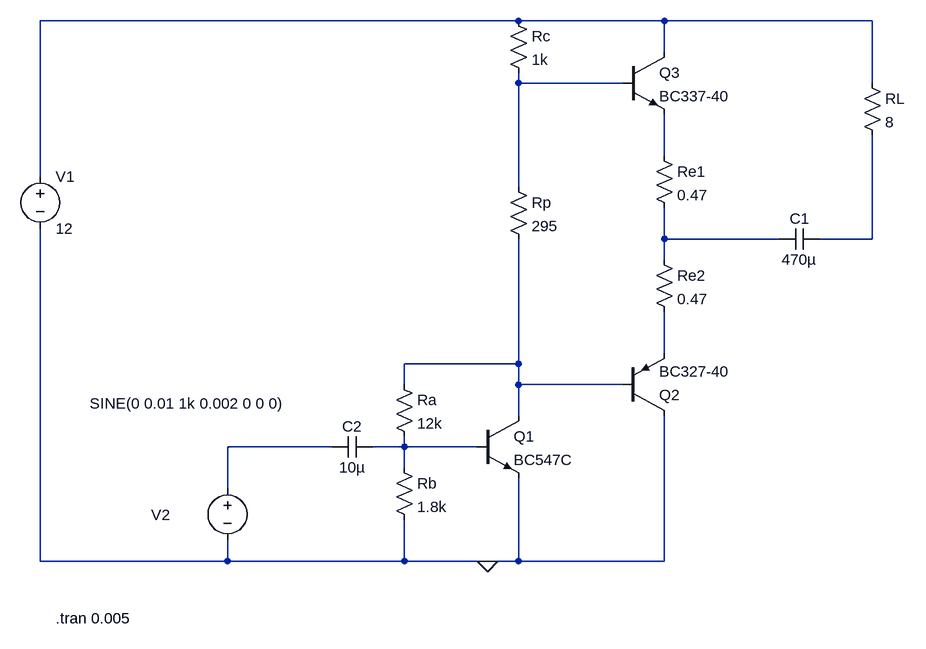
[diagram p0: schematic Draft9.asc]
Draft9.asc, the LTspice schematic file:
Version 4
SHEET 1 1140 680
WIRE 272 -480 -464 -480
WIRE 496 -480 272 -480
WIRE 816 -480 496 -480
WIRE 496 -432 496 -480
WIRE 272 -384 272 -400
WIRE 432 -384 272 -384
WIRE 816 -384 816 -480
WIRE 496 -272 496 -336
WIRE -464 -240 -464 -480
WIRE 272 -224 272 -384
WIRE 496 -144 496 -192
WIRE 672 -144 496 -144
WIRE 816 -144 816 -304
WIRE 816 -144 736 -144
WIRE 496 -112 496 -144
WIRE 496 32 496 -32
WIRE 272 48 272 -144
WIRE 272 48 96 48
WIRE 96 80 96 48
WIRE 272 80 272 48
WIRE 432 80 272 80
WIRE 272 128 272 80
WIRE -16 176 -176 176
WIRE 96 176 96 160
WIRE 96 176 48 176
WIRE 208 176 96 176
WIRE 96 208 96 176
WIRE -176 240 -176 176
WIRE -464 352 -464 -160
WIRE -176 352 -176 320
WIRE -176 352 -464 352
WIRE 96 352 96 288
WIRE 96 352 -176 352
WIRE 224 352 96 352
WIRE 272 352 272 224
WIRE 272 352 224 352
WIRE 496 352 496 128
WIRE 496 352 272 352
FLAG 224 352 0
SYMBOL res 80 64 R0
SYMATTR InstName Ra
SYMATTR Value 12k
SYMBOL res 80 192 R0
SYMATTR InstName Rb
SYMATTR Value 1.8k
SYMBOL npn 208 128 R0
SYMATTR InstName Q1
SYMATTR Value BC547C
SYMBOL voltage -464 -256 R0
SYMATTR InstName V1
SYMATTR Value 12
SYMBOL res 256 -240 R0
SYMATTR InstName Rp
SYMATTR Value 295
SYMBOL res 256 -496 R0
SYMATTR InstName Rc
SYMATTR Value 1k
SYMBOL res 480 -288 R0
SYMATTR InstName Re1
SYMATTR Value 0.47
SYMBOL res 480 -128 R0
SYMATTR InstName Re2
SYMATTR Value 0.47
SYMBOL res 800 -400 R0
SYMATTR InstName RL
SYMATTR Value 8
SYMBOL cap 736 -160 R90
WINDOW 0 0 32 VBottom 2
WINDOW 3 32 32 VTop 2
SYMATTR InstName C1
SYMATTR Value 470µ
SYMBOL cap 48 160 R90
WINDOW 0 0 32 VBottom 2
WINDOW 3 32 32 VTop 2
SYMATTR InstName C2
SYMATTR Value 10µ
SYMBOL voltage -176 224 R0
WINDOW 0 -117 57 Left 2
WINDOW 3 -212 -115 Left 2
WINDOW 123 0 0 Left 0
WINDOW 39 0 0 Left 0
SYMATTR InstName V2
SYMATTR Value SINE(0 0.01 1k 0.002 0 0 0)
SYMBOL pnp 432 128 M180
SYMATTR InstName Q2
SYMATTR Value BC327-40
SYMBOL npn 432 -432 R0
SYMATTR InstName Q3
SYMATTR Value BC337-40
TEXT -440 440 Left 2 !.tran 0.005

The netlist it stands for:
* Draft9.asc
Ra N007 N009 12k
Rb N009 0 1.8k
Q1 N007 N009 0 0 BC547C
V1 N001 0 12
Rp N002 N007 295
Rc N001 N002 1k
Re1 N003 N004 0.47
Re2 N004 N006 0.47
RL N001 N005 8
C1 N005 N004 470µ
C2 N009 N008 10µ
V2 N008 0 SINE(0 0.01 1k 0.002 0 0 0)
Q2 0 N007 N006 0 BC327-40
Q3 N001 N002 N003 0 BC337-40
.model NPN NPN
.model PNP PNP
.lib standard.bjt
.tran 0.005
.backanno
.end